# Altium schematic sheet ESP32_USBC.SchDoc (part 1 of 3)
size 594 x 420 mm; SheetNumber: 1; SheetTotal: 1; Sheet_Name: Insert name in Document Parameters; Size: 11x17
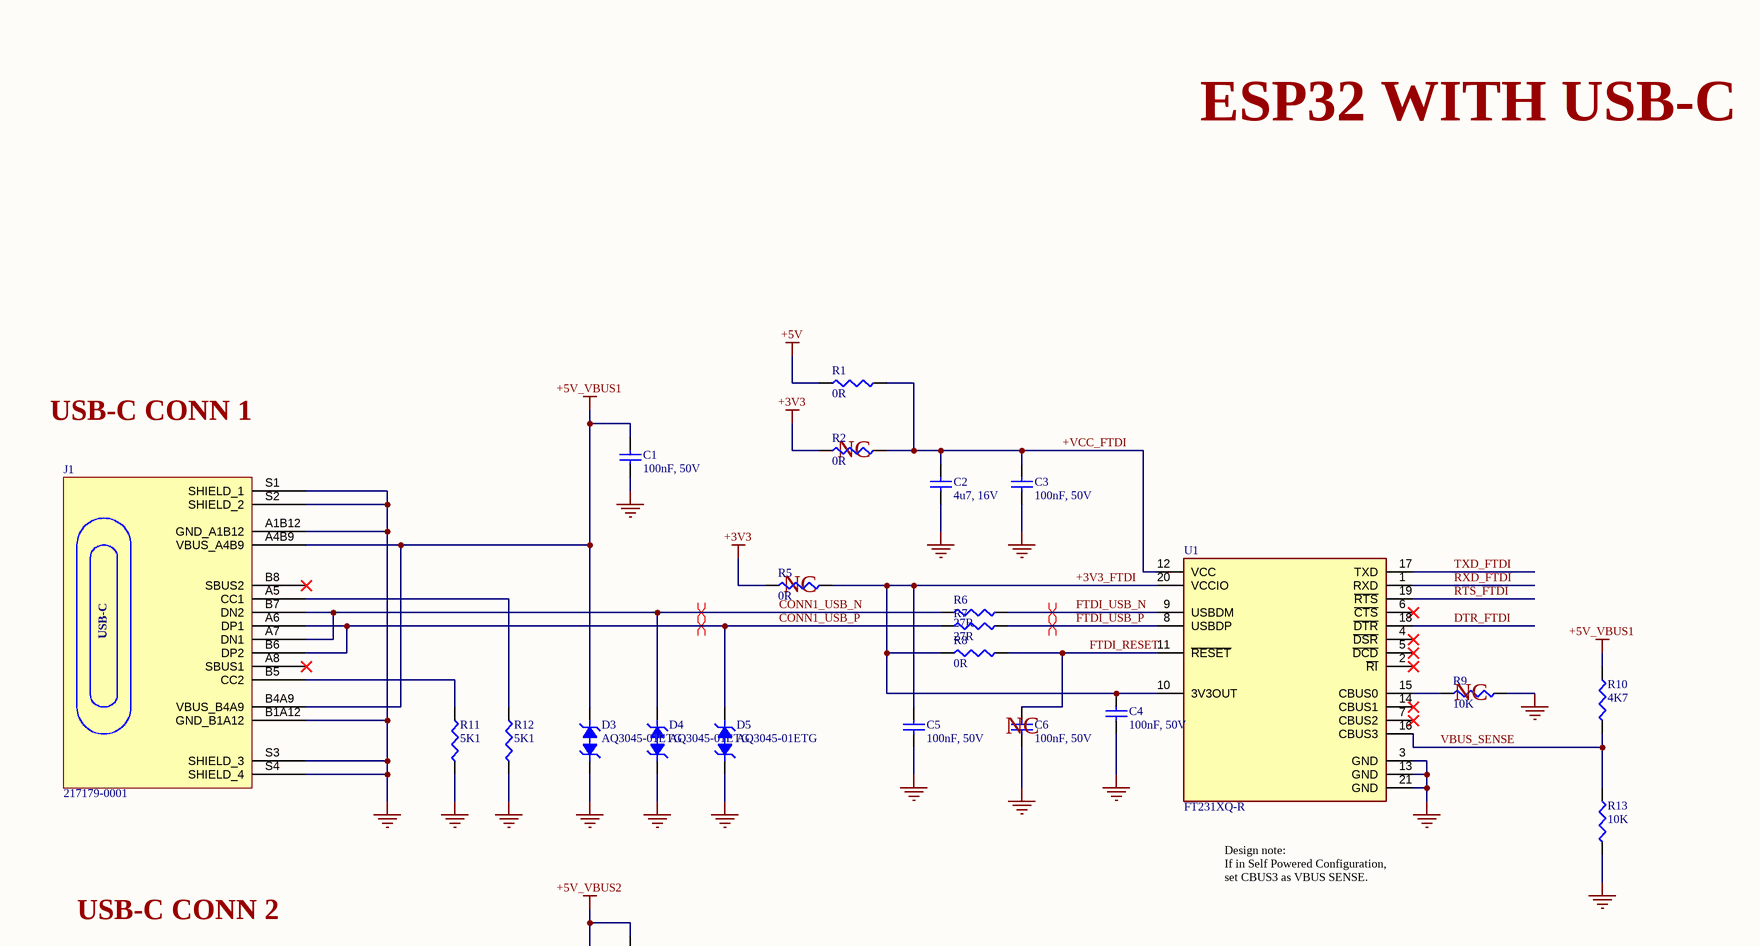
[diagram p0: ESP32_USBC.SchDoc, top left]
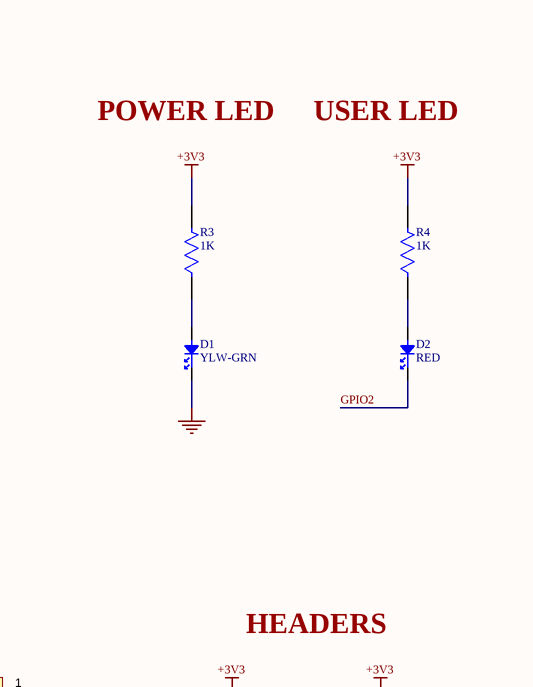
[diagram p1: ESP32_USBC.SchDoc, top right]
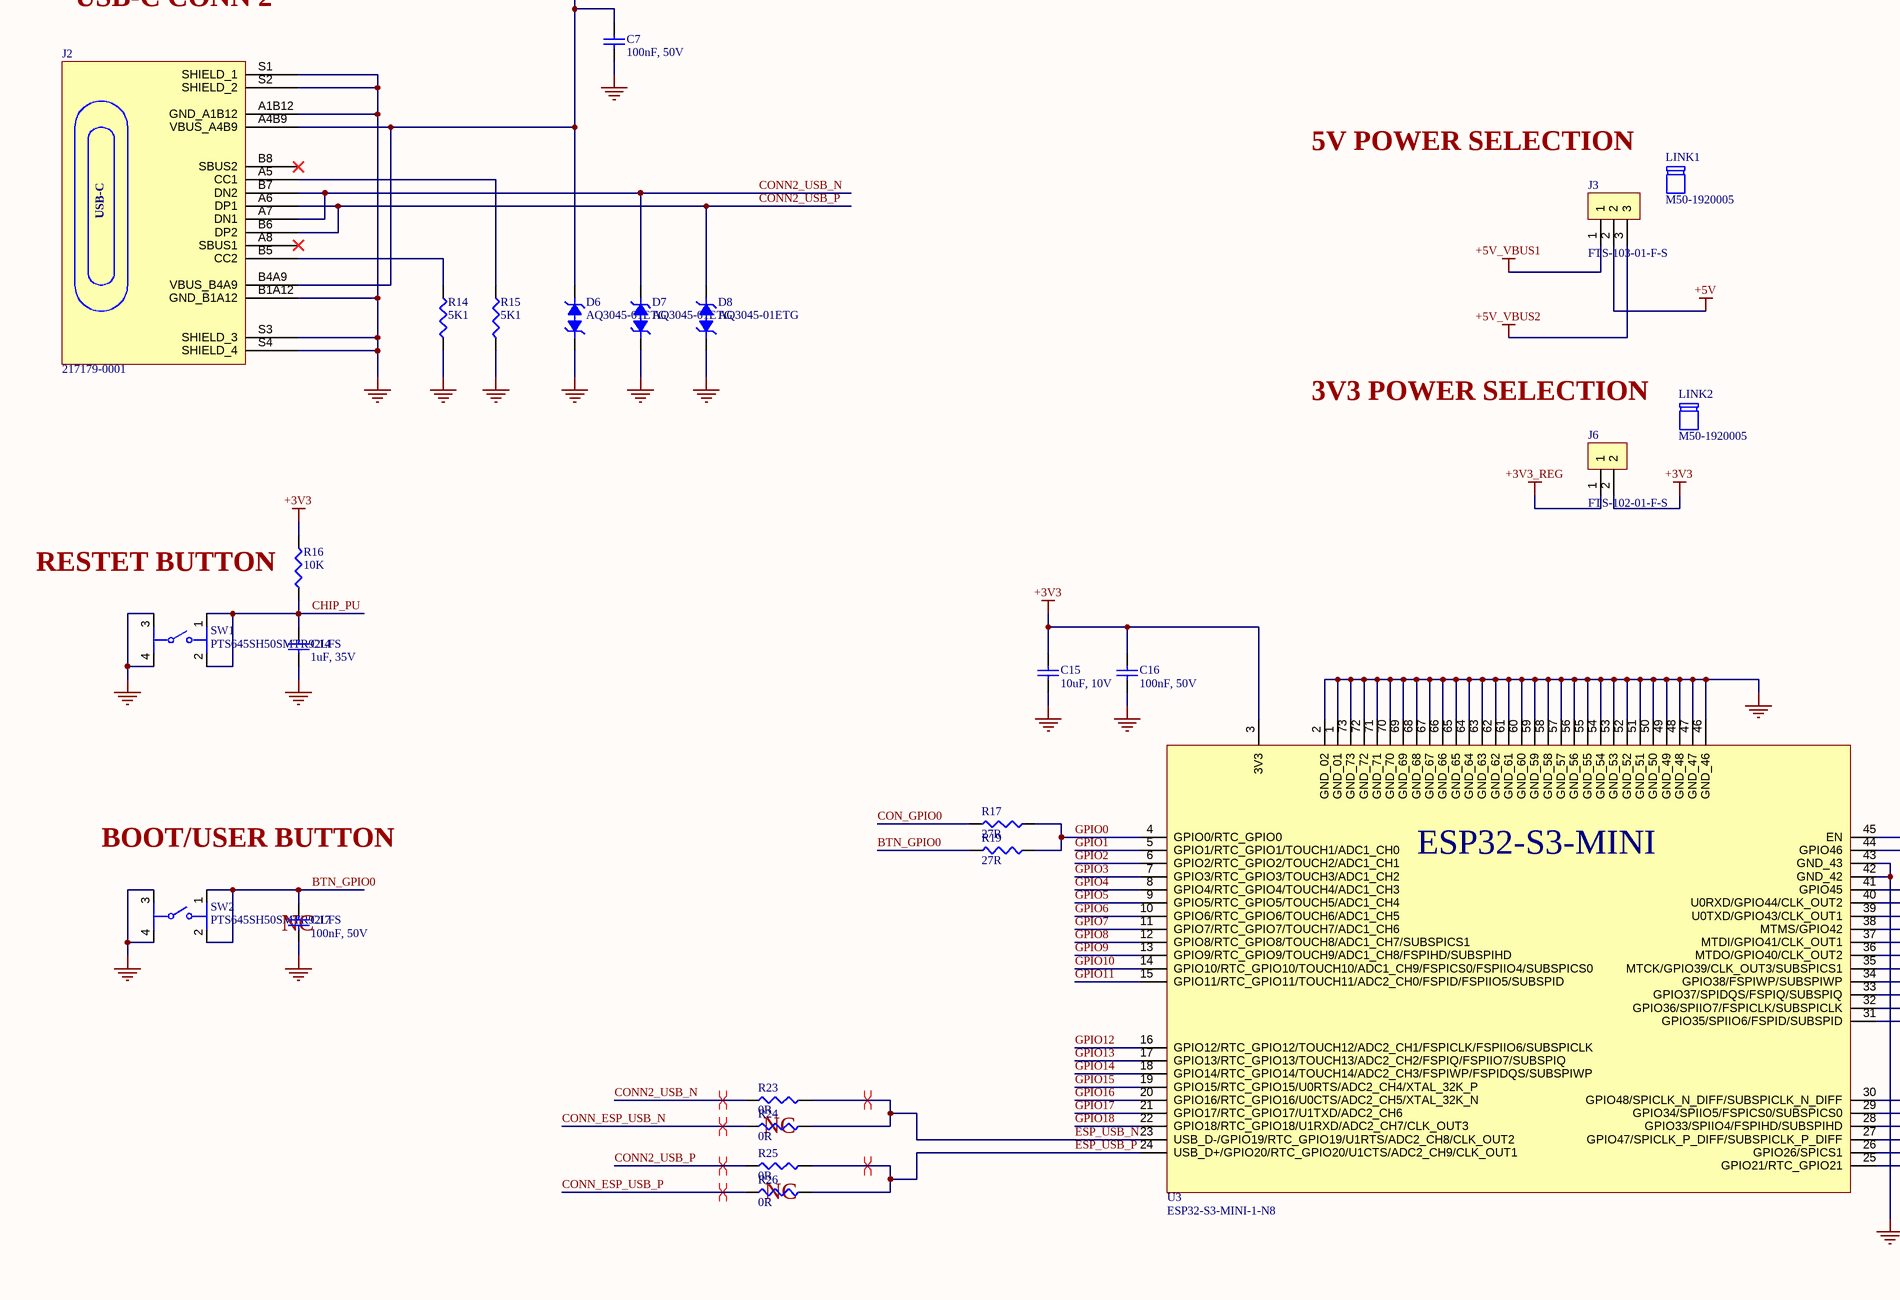
[diagram p2: ESP32_USBC.SchDoc, bottom left]
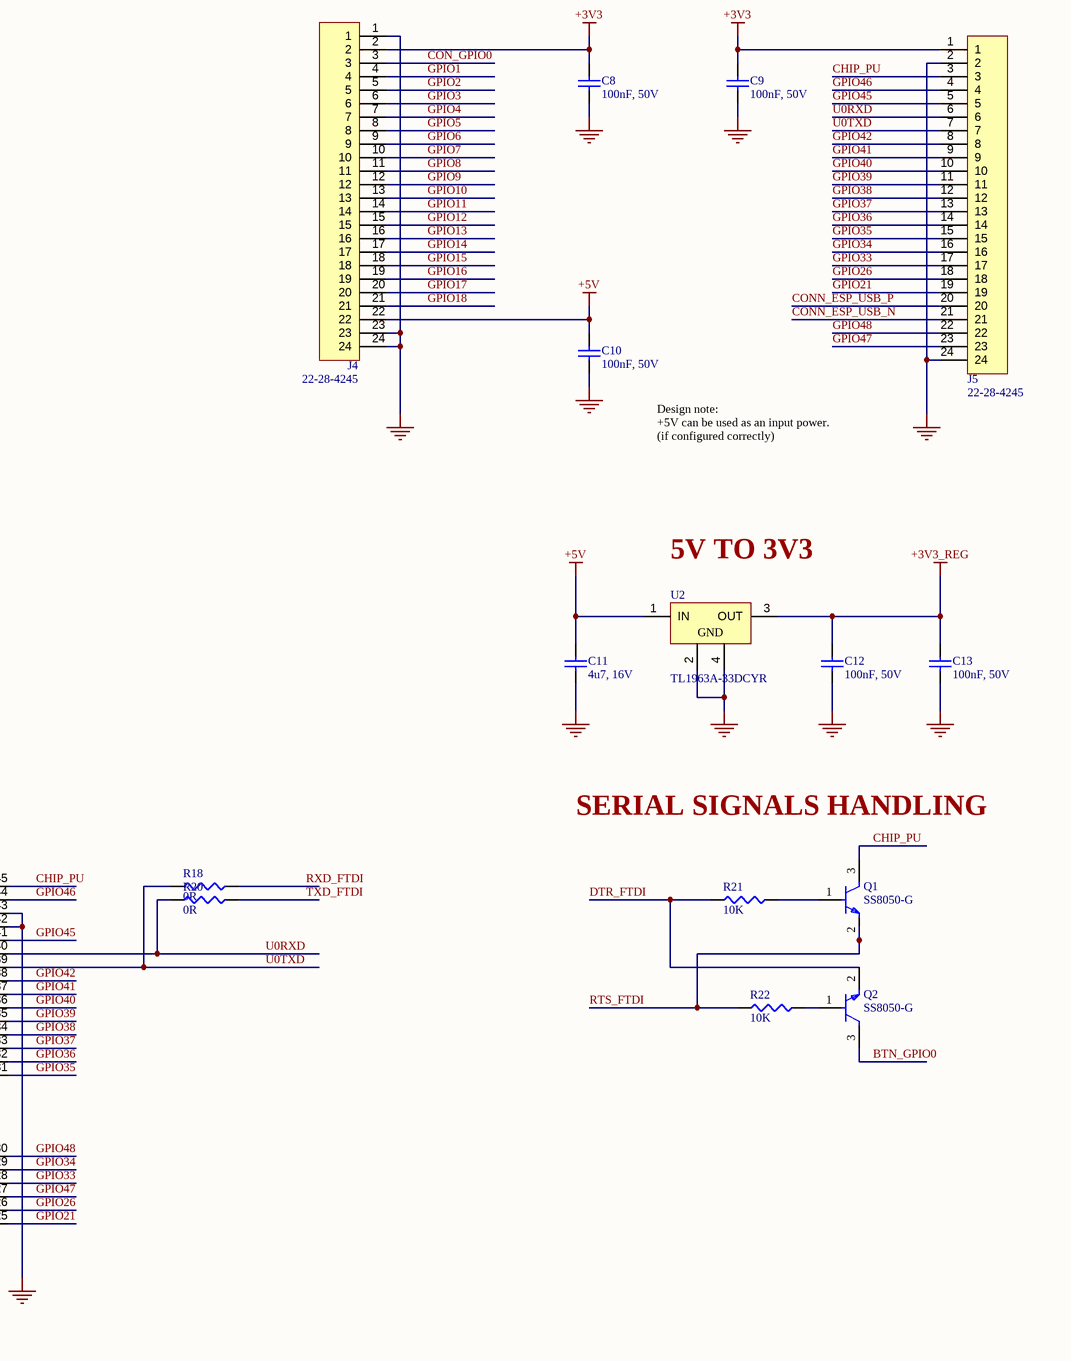
[diagram p3: ESP32_USBC.SchDoc, bottom right]

## Parts
C1  100nF, 50V  [CAPC1005X65N]
C2  4u7, 16V  [CAPC1005X65N]
C3  100nF, 50V  [CAPC1005X65N]
C4  100nF, 50V  [CAPC1005X65N]
C5  100nF, 50V  [CAPC1005X65N]
C6  100nF, 50V  [CAPC1005X65N]
C7  100nF, 50V  [CAPC1005X65N]
C8  100nF, 50V  [CAPC1005X65N]
C9  100nF, 50V  [CAPC1005X65N]
C10  100nF, 50V  [CAPC1005X65N]
C11  4u7, 16V  [CAPC1005X65N]
C12  100nF, 50V  [CAPC1005X65N]
C13  100nF, 50V  [CAPC1005X65N]
C14  1uF, 35V  [CAPC1005X65N]
C15  10uF, 10V  [CAPC1005X65N]
C16  100nF, 50V  [CAPC1005X65N]
C17  100nF, 50V  [CAPC1005X65N]
D1  YLW-GRN  [LED0402G]
D2  RED  [LED0402R]
D3  AQ3045-01ETG  [SOD882]
D4  AQ3045-01ETG  [SOD882]
D5  AQ3045-01ETG  [SOD882]
D6  AQ3045-01ETG  [SOD882]
D7  AQ3045-01ETG  [SOD882]
D8  AQ3045-01ETG  [SOD882]
J1  217179-0001  [FP-2171790001-MFG]
J2  217179-0001  [FP-2171790001-MFG]
J3  FTS-103-01-F-S  [HDR_1X3_1.27MM]
J4  22-28-4245  [HDR_1X24_2.54MM]
J5  22-28-4245  [HDR_1X24_2.54MM]
J6  FTS-102-01-F-S  [HDR_1X2_1.27MM]
LINK1  M50-1920005  (mechanical)
LINK2  M50-1920005  (mechanical)
Q1  SS8050-G  [FP-SS8050-G-IPC_B]
Q2  SS8050-G  [FP-SS8050-G-IPC_B]
R1  0R  [RESC1005X37N]
R2  0R  [RESC1005X37N]
R3  1K  [RESC1005X37N]
R4  1K  [RESC1005X37N]
R5  0R  [RESC1005X37N]
R6  27R  [RESC1005X37N]
R7  27R  [RESC1005X37N]
R8  0R  [RESC1005X37N]
R9  10K  [RESC1005X37N]
R10  4K7  [RESC1005X37N]
R11  5K1  [RESC1005X37N]
R12  5K1  [RESC1005X37N]
R13  10K  [RESC1005X37N]
R14  5K1  [RESC1005X37N]
R15  5K1  [RESC1005X37N]
R16  10K  [RESC1005X37N]
R17  27R  [RESC1005X37N]
R18  0R  [RESC1005X37N]
R19  27R  [RESC1005X37N]
R20  0R  [RESC1005X37N]
R21  10K  [RESC1005X37N]
R22  10K  [RESC1005X37N]
R23  0R  [RESC1005X37N]
R24  0R  [RESC1005X37N]
R25  0R  [RESC1005X37N]
R26  0R  [RESC1005X37N]
SW1  PTS645SH50SMTR92LFS  [FP-PTS645SH50SMTR92LFS-MFG]
SW2  PTS645SH50SMTR92LFS  [FP-PTS645SH50SMTR92LFS-MFG]
U1  FT231XQ-R  [FP-QFN-20-IPC_B]
U2  TL1963A-33DCYR  [DCY0004A_N]
U3  ESP32-S3-MINI-1-N8  [XCVR_ESP32-S3-MINI-1-N8]

## Nets
+3V3: C8.2 C9.2 C15.2 C16.2 J4.2 J5.1 J6.2 R2.1 R3.2 R4.2 R5.1 R16.2 U3.3(3V3)
+3V3_REG: C12.2 C13.2 J6.1 U2.3(OUT)
+5V: C10.2 C11.2 J3.2 J4.22 R1.1 U2.1(IN)
+5V_VBUS1: C1.2 D3.2 J1.A4B9(VBUS_A4B9) J1.B4A9(VBUS_B4A9) J3.1 R10.2
+5V_VBUS2: C7.2 D6.2 J2.A4B9(VBUS_A4B9) J2.B4A9(VBUS_B4A9) J3.3
GND: C1.1 C2.1 C3.2 C4.2 C5.2 C6.2 C7.1 C8.1 C9.1 C10.1 C11.1 C12.1 C13.1 C14.1 C15.1 C16.1 C17.1 D1.1 D3.1 D4.1 D5.1 D6.1 D7.1 D8.1 J1.A1B12(GND_A1B12) J1.B1A12(GND_B1A12) J1.S1(SHIELD_1) J1.S2(SHIELD_2) J1.S3(SHIELD_3) J1.S4(SHIELD_4) J2.A1B12(GND_A1B12) J2.B1A12(GND_B1A12) J2.S1(SHIELD_1) J2.S2(SHIELD_2) J2.S3(SHIELD_3) J2.S4(SHIELD_4) J4.1 J4.23 J4.24 J5.2 J5.24 R9.1 R11.1 R12.1 R13.1 R14.1 R15.1 SW1.3 SW1.4 SW2.3 SW2.4 U1.3(GND) U1.13(GND) U1.21(GND) U2.2(GND) U2.4(GND) U3.1(GND_01) U3.2(GND_02) U3.42(GND_42) U3.43(GND_43) U3.46(GND_46) U3.47(GND_47) U3.48(GND_48) U3.49(GND_49) U3.50(GND_50) U3.51(GND_51) U3.52(GND_52) U3.53(GND_53) U3.54(GND_54) U3.55(GND_55) U3.56(GND_56) U3.57(GND_57) U3.58(GND_58) U3.59(GND_59) U3.60(GND_60) U3.61(GND_61) U3.62(GND_62) U3.63(GND_63) U3.64(GND_64) U3.65(GND_65) U3.66(GND_66) U3.67(GND_67) U3.68(GND_68) U3.69(GND_69) U3.70(GND_70) U3.71(GND_71) U3.72(GND_72) U3.73(GND_73)
+3V3_FTDI: C4.1 C5.1 R5.2 R8.1 U1.10(3V3OUT) U1.20(VCCIO)
+VCC_FTDI: C2.2 C3.1 R1.2 R2.2 U1.12(VCC)
BTN_GPIO0: C17.2 Q2.3(C) R19.2 SW2.1 SW2.2
CHIP_PU: C14.2 J5.3 Q1.3(C) R16.1 SW1.1 SW1.2 U3.45(EN)
CON_GPIO0: J4.3 R17.2
CONN1_USB_N: D4.2 J1.A7(DN1) J1.B7(DN2) R6.2
CONN1_USB_P: D5.2 J1.A6(DP1) J1.B6(DP2) R7.2
CONN2_USB_N: D7.2 J2.A7(DN1) J2.B7(DN2) R23.1
CONN2_USB_P: D8.2 J2.A6(DP1) J2.B6(DP2) R25.1
CONN_ESP_USB_N: J5.21 R24.1
CONN_ESP_USB_P: J5.20 R26.1
DTR_FTDI: Q2.2(E) R21.2 U1.18(~{DTR})
ESP_USB_N: R23.2 R24.2 U3.23(USB_D-/GPIO19/RTC_GPIO19/U1RTS/ADC2_CH8/CLK_OUT2)
ESP_USB_P: R25.2 R26.2 U3.24(USB_D+/GPIO20/RTC_GPIO20/U1CTS/ADC2_CH9/CLK_OUT1)
FTDI_RESET: C6.1 R8.2 U1.11(~{RESET})
FTDI_USB_N: R6.1 U1.9(USBDM)
FTDI_USB_P: R7.1 U1.8(USBDP)
GPIO0: R17.1 R19.1 U3.4(GPIO0/RTC_GPIO0)
GPIO1: J4.4 U3.5(GPIO1/RTC_GPIO1/TOUCH1/ADC1_CH0)
GPIO2: D2.1 J4.5 U3.6(GPIO2/RTC_GPIO2/TOUCH2/ADC1_CH1)
GPIO3: J4.6 U3.7(GPIO3/RTC_GPIO3/TOUCH3/ADC1_CH2)
GPIO4: J4.7 U3.8(GPIO4/RTC_GPIO4/TOUCH4/ADC1_CH3)
GPIO5: J4.8 U3.9(GPIO5/RTC_GPIO5/TOUCH5/ADC1_CH4)
GPIO6: J4.9 U3.10(GPIO6/RTC_GPIO6/TOUCH6/ADC1_CH5)
GPIO7: J4.10 U3.11(GPIO7/RTC_GPIO7/TOUCH7/ADC1_CH6)
GPIO8: J4.11 U3.12(GPIO8/RTC_GPIO8/TOUCH8/ADC1_CH7/SUBSPICS1)
GPIO9: J4.12 U3.13(GPIO9/RTC_GPIO9/TOUCH9/ADC1_CH8/FSPIHD/SUBSPIHD)
GPIO10: J4.13 U3.14(GPIO10/RTC_GPIO10/TOUCH10/ADC1_CH9/FSPICS0/FSPIIO4/SUBSPICS0)
GPIO11: J4.14 U3.15(GPIO11/RTC_GPIO11/TOUCH11/ADC2_CH0/FSPID/FSPIIO5/SUBSPID)
GPIO12: J4.15 U3.16(GPIO12/RTC_GPIO12/TOUCH12/ADC2_CH1/FSPICLK/FSPIIO6/SUBSPICLK)
GPIO13: J4.16 U3.17(GPIO13/RTC_GPIO13/TOUCH13/ADC2_CH2/FSPIQ/FSPIIO7/SUBSPIQ)
GPIO14: J4.17 U3.18(GPIO14/RTC_GPIO14/TOUCH14/ADC2_CH3/FSPIWP/FSPIDQS/SUBSPIWP)
GPIO15: J4.18 U3.19(GPIO15/RTC_GPIO15/U0RTS/ADC2_CH4/XTAL_32K_P)
GPIO16: J4.19 U3.20(GPIO16/RTC_GPIO16/U0CTS/ADC2_CH5/XTAL_32K_N)
GPIO17: J4.20 U3.21(GPIO17/RTC_GPIO17/U1TXD/ADC2_CH6)
GPIO18: J4.21 U3.22(GPIO18/RTC_GPIO18/U1RXD/ADC2_CH7/CLK_OUT3)
GPIO21: J5.19 U3.25(GPIO21/RTC_GPIO21)
GPIO26: J5.18 U3.26(GPIO26/SPICS1)
GPIO33: J5.17 U3.28(GPIO33/SPIIO4/FSPIHD/SUBSPIHD)
GPIO34: J5.16 U3.29(GPIO34/SPIIO5/FSPICS0/SUBSPICS0)
GPIO35: J5.15 U3.31(GPIO35/SPIIO6/FSPID/SUBSPID)
GPIO36: J5.14 U3.32(GPIO36/SPIIO7/FSPICLK/SUBSPICLK)
GPIO37: J5.13 U3.33(GPIO37/SPIDQS/FSPIQ/SUBSPIQ)
GPIO38: J5.12 U3.34(GPIO38/FSPIWP/SUBSPIWP)
GPIO39: J5.11 U3.35(MTCK/GPIO39/CLK_OUT3/SUBSPICS1)
GPIO40: J5.10 U3.36(MTDO/GPIO40/CLK_OUT2)
GPIO41: J5.9 U3.37(MTDI/GPIO41/CLK_OUT1)
GPIO42: J5.8 U3.38(MTMS/GPIO42)
GPIO45: J5.5 U3.41(GPIO45)
GPIO46: J5.4 U3.44(GPIO46)
GPIO47: J5.23 U3.27(GPIO47/SPICLK_P_DIFF/SUBSPICLK_P_DIFF)
GPIO48: J5.22 U3.30(GPIO48/SPICLK_N_DIFF/SUBSPICLK_N_DIFF)
RTS_FTDI: Q1.2(E) R22.2 U1.19(~{RTS})
RXD_FTDI: R18.2 U1.1(RXD)
TXD_FTDI: R20.2 U1.17(TXD)
U0RXD: J5.6 R20.1 U3.40(U0RXD/GPIO44/CLK_OUT2)
U0TXD: J5.7 R18.1 U3.39(U0TXD/GPIO43/CLK_OUT1)
VBUS_SENSE: R10.1 R13.2 U1.16(CBUS3)
NetD1_2: D1.2 R3.1
NetD2_2: D2.2 R4.1
NetJ1_A5: J1.A5(CC1) R12.2
NetJ1_B5: J1.B5(CC2) R11.2
NetJ2_A5: J2.A5(CC1) R15.2
NetJ2_B5: J2.B5(CC2) R14.2
NetQ1_1: Q1.1(B) R21.1
NetQ2_1: Q2.1(B) R22.1
NetR9_2: R9.2 U1.15(CBUS0)

Not connected (* = marked no-connect by the designer): J1 A8(SBUS1)* B8(SBUS2)*; J2 A8(SBUS1)* B8(SBUS2)*; U1 2(~{RI})* 4(~{DSR})* 5(~{DCD})* 6(~{CTS})* 7(CBUS2)* 14(CBUS1)*

## Layout directives
differential pair; differential pair class DIFF90: CONN1_USB_N, CONN1_USB_P, CONN2_USB_N, CONN2_USB_P, CONN_ESP_USB_N, CONN_ESP_USB_P, ESP_USB_N, ESP_USB_P, FTDI_USB_N, FTDI_USB_P

## Notes on the sheet
- ESP32 WITH USB-C
- POWER LED
- USER LED
- USB-C CONN 1
- (near R2) NC
- (near R5) NC
- (near C6) NC
- (near R9) NC
- HEADERS
- USB-C CONN 2
- Design note:
  If in Self Powered Configuration, set CBUS3 as VBUS SENSE.
- 5V POWER SELECTION
- 3V3 POWER SELECTION
- Design note:
  +5V can be used as an input power.
  (if configured correctly)
- (near U2) 5V TO 3V3
- RESTET BUTTON
- SERIAL SIGNALS HANDLING
- BOOT/USER BUTTON
- (near C17) NC
- (near R24) NC
- (near R26) NC
- DWG NO:
- REV:
- THIS DOCUMENT AND THE DATA DISCLOSED HEREIN OR
- HEREWITH IS THE PROPERTY OF ALTIUM LIMITED AND MAY
- BE FREELY DISTRIBUTED IN WHOLE. NO RIGHTS ARE
- RESERVED OR EXPRESS OR IMPLIED WARANTEE GIVEN.
- REVISION
- DESCRIPTION
- DATE
- APPROVED
- ENG:
- APPROVALS
- PROJECT
- DSN:
- CHK:
- REFERENCE DOCUMENTS
- PROJECT REVISION:
- TITLE
- DOCUMENT REVISION:
- DESIGN ITEM:
- BOM:
- FAB DWG:
- PCB DWG:
- ASSY DWG:
- SCALE:
- A2
- SIZE
- CAGE CODE
- FILE NAME
- DWG NO.
- SHEET
- OF
- REV
- (in symbol 217179-0001) USB-C
- (in symbol ESP32-S3-MINI-1-N8) ESP32-S3-MINI